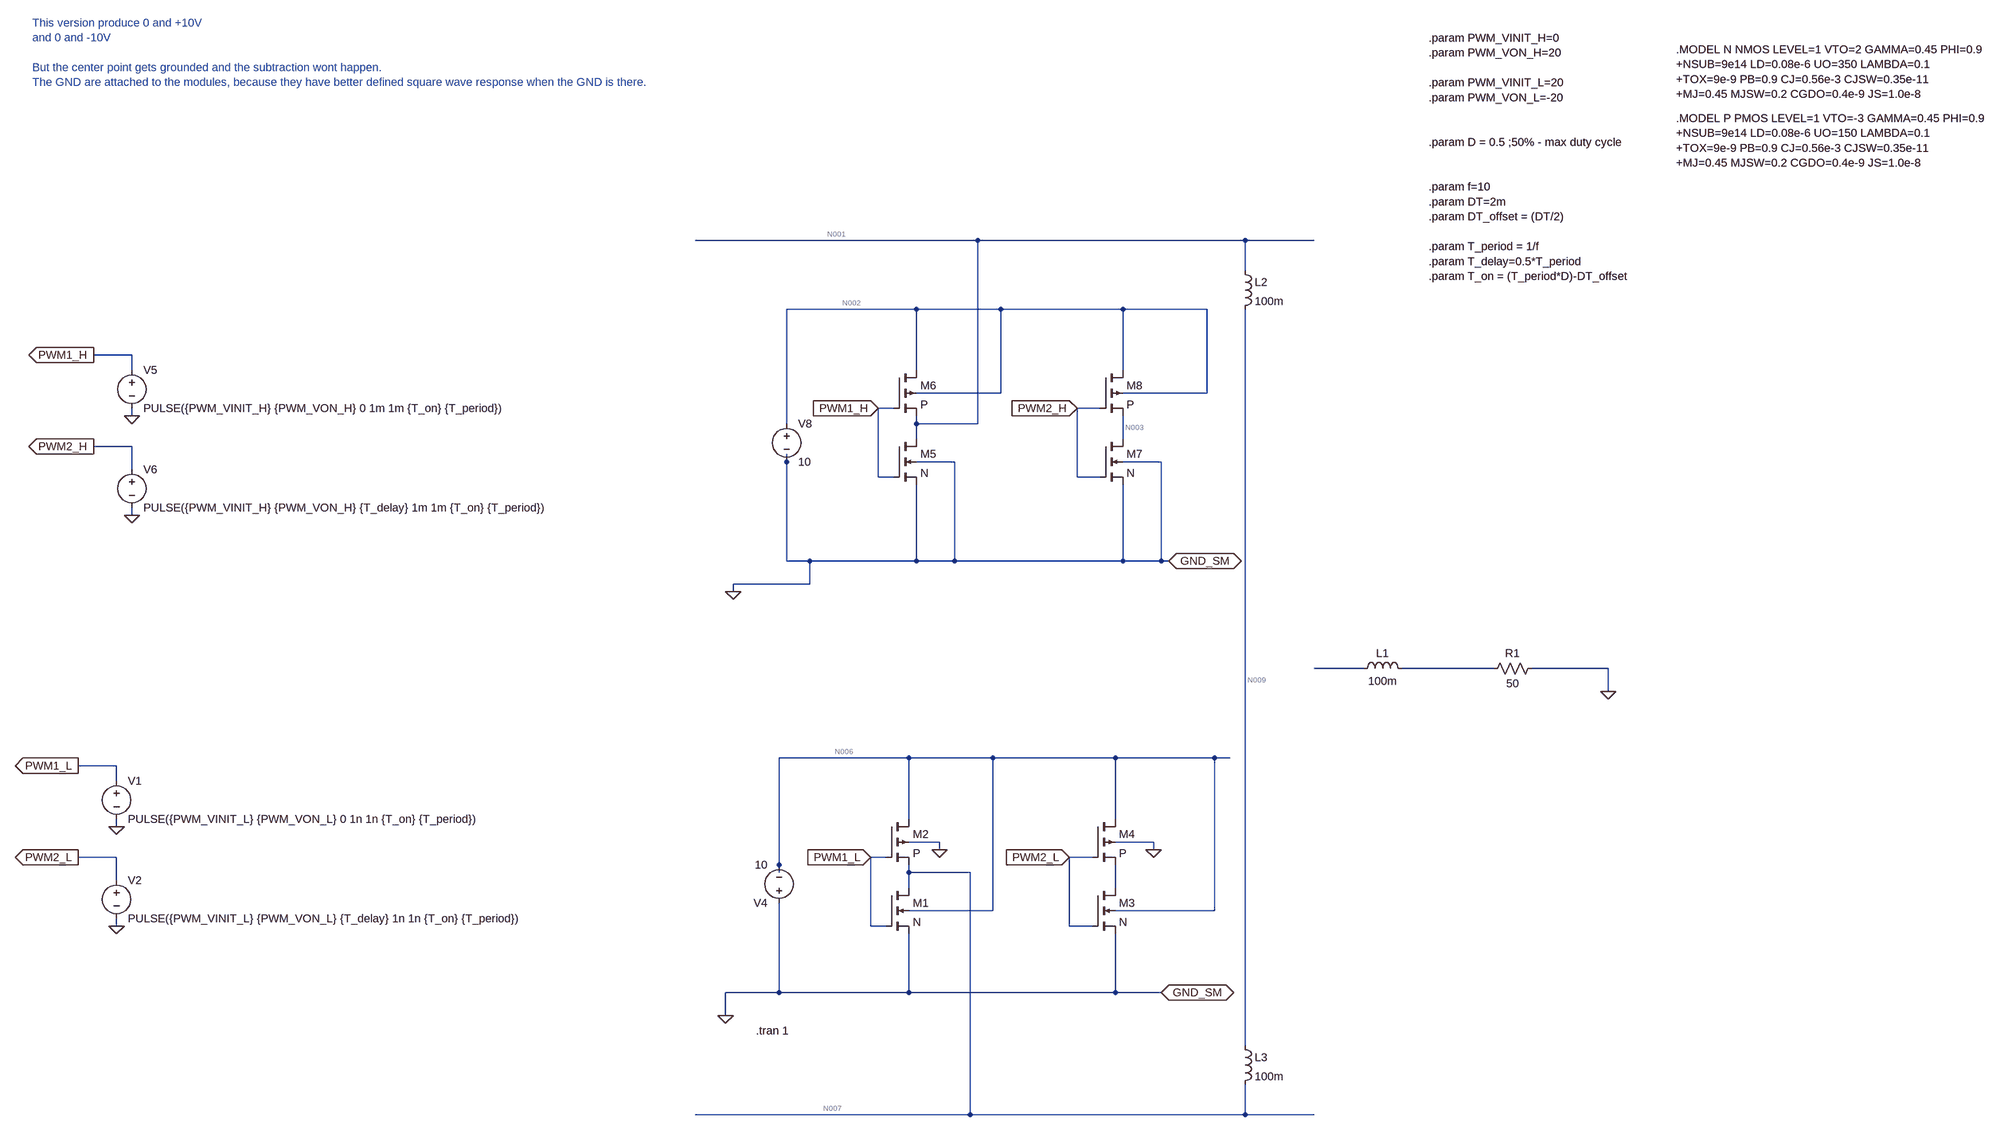
[diagram p0: schematic 2sb.asc]
2sb.asc, the LTspice schematic file:
Version 4.1
SHEET 1 1732 1656
WIRE -2432 -384 -3024 -384
WIRE -1872 -384 -2432 -384
WIRE -1728 -384 -1872 -384
WIRE -1872 -320 -1872 -384
WIRE -2560 -240 -2832 -240
WIRE -2384 -240 -2560 -240
WIRE -2128 -240 -2384 -240
WIRE -1952 -240 -2128 -240
WIRE -4208 -144 -4288 -144
WIRE -4208 -112 -4208 -144
WIRE -2560 -112 -2560 -240
WIRE -2128 -112 -2128 -240
WIRE -2384 -64 -2384 -240
WIRE -2384 -64 -2560 -64
WIRE -1952 -64 -1952 -240
WIRE -1952 -64 -2128 -64
WIRE -2608 -32 -2640 -32
WIRE -2176 -32 -2224 -32
WIRE -4208 -16 -4208 -32
WIRE -2832 0 -2832 -240
WIRE -2560 0 -2560 -16
WIRE -2432 0 -2432 -384
WIRE -2432 0 -2560 0
WIRE -2560 32 -2560 0
WIRE -2128 32 -2128 -16
WIRE -4208 48 -4288 48
WIRE -2832 80 -2832 64
WIRE -2480 80 -2560 80
WIRE -2048 80 -2128 80
WIRE -4208 96 -4208 48
WIRE -2640 112 -2640 -32
WIRE -2608 112 -2640 112
WIRE -2224 112 -2224 -32
WIRE -2176 112 -2224 112
WIRE -4208 192 -4208 176
WIRE -2832 288 -2832 80
WIRE -2784 288 -2832 288
WIRE -2560 288 -2560 128
WIRE -2560 288 -2784 288
WIRE -2480 288 -2480 80
WIRE -2480 288 -2560 288
WIRE -2128 288 -2128 128
WIRE -2128 288 -2480 288
WIRE -2048 288 -2048 80
WIRE -2048 288 -2128 288
WIRE -2032 288 -2048 288
WIRE -2784 336 -2784 288
WIRE -2784 336 -2944 336
WIRE -2944 352 -2944 336
WIRE -1344 608 -1728 608
WIRE -1072 608 -1264 608
WIRE -832 608 -992 608
WIRE -832 656 -832 608
WIRE -2576 864 -2848 864
WIRE -2400 864 -2576 864
WIRE -2144 864 -2400 864
WIRE -1936 864 -2144 864
WIRE -1904 864 -1936 864
WIRE -4240 880 -4320 880
WIRE -4240 912 -4240 880
WIRE -2576 992 -2576 864
WIRE -2144 992 -2144 864
WIRE -4240 1008 -4240 992
WIRE -2512 1040 -2576 1040
WIRE -2064 1040 -2144 1040
WIRE -2512 1056 -2512 1040
WIRE -2064 1056 -2064 1040
WIRE -4240 1072 -4320 1072
WIRE -2624 1072 -2656 1072
WIRE -2192 1072 -2240 1072
WIRE -2848 1088 -2848 864
WIRE -2848 1104 -2848 1088
WIRE -2576 1104 -2576 1088
WIRE -2448 1104 -2576 1104
WIRE -4240 1120 -4240 1072
WIRE -2576 1136 -2576 1104
WIRE -2144 1136 -2144 1088
WIRE -2400 1184 -2400 864
WIRE -2400 1184 -2576 1184
WIRE -1936 1184 -1936 864
WIRE -1936 1184 -2144 1184
WIRE -4240 1216 -4240 1200
WIRE -2656 1216 -2656 1072
WIRE -2624 1216 -2656 1216
WIRE -2240 1216 -2240 1072
WIRE -2192 1216 -2240 1216
WIRE -2848 1392 -2848 1168
WIRE -2848 1392 -2960 1392
WIRE -2576 1392 -2576 1232
WIRE -2576 1392 -2848 1392
WIRE -2144 1392 -2144 1232
WIRE -2144 1392 -2576 1392
WIRE -2048 1392 -2144 1392
WIRE -2960 1440 -2960 1392
WIRE -1872 1504 -1872 -240
WIRE -2448 1648 -2448 1104
WIRE -2448 1648 -3024 1648
WIRE -1872 1648 -1872 1584
WIRE -1872 1648 -2448 1648
WIRE -1728 1648 -1872 1648
FLAG -2656 1072 PWM1_L
IOPIN -2656 1072 In
FLAG -2240 1072 PWM2_L
IOPIN -2240 1072 In
FLAG -4240 1008 0
FLAG -4240 1216 0
FLAG -4320 880 PWM1_L
IOPIN -4320 880 Out
FLAG -4320 1072 PWM2_L
IOPIN -4320 1072 Out
FLAG -2048 1392 GND_SM
IOPIN -2048 1392 BiDir
FLAG -2512 1056 0
FLAG -2064 1056 0
FLAG -2640 -32 PWM1_H
IOPIN -2640 -32 In
FLAG -2224 -32 PWM2_H
IOPIN -2224 -32 In
FLAG -4208 -16 0
FLAG -4208 192 0
FLAG -4288 -144 PWM1_H
IOPIN -4288 -144 Out
FLAG -4288 48 PWM2_H
IOPIN -4288 48 Out
FLAG -2032 288 GND_SM
IOPIN -2032 288 BiDir
FLAG -2944 352 0
FLAG -2960 1440 0
FLAG -832 656 0
SYMBOL nmos4 -2624 1136 R0
SYMATTR InstName M1
SYMATTR Value N
SYMBOL pmos4 -2624 992 R0
SYMATTR InstName M2
SYMATTR Value P
SYMBOL nmos4 -2192 1136 R0
SYMATTR InstName M3
SYMATTR Value N
SYMBOL pmos4 -2192 992 R0
SYMATTR InstName M4
SYMATTR Value P
SYMBOL voltage -4240 896 R0
WINDOW 123 0 0 Left 0
WINDOW 39 0 0 Left 0
SYMATTR InstName V1
SYMATTR Value PULSE({PWM_VINIT_L} {PWM_VON_L} 0 1n 1n {T_on} {T_period})
SYMBOL voltage -4240 1104 R0
WINDOW 123 0 0 Left 0
WINDOW 39 0 0 Left 0
SYMATTR InstName V2
SYMATTR Value PULSE({PWM_VINIT_L} {PWM_VON_L} {T_delay} 1n 1n {T_on} {T_period})
SYMBOL voltage -2848 1184 R180
WINDOW 123 0 0 Left 0
WINDOW 39 0 0 Left 0
SYMATTR InstName V4
SYMATTR Value 10
SYMBOL nmos4 -2608 32 R0
SYMATTR InstName M5
SYMATTR Value N
SYMBOL pmos4 -2608 -112 R0
SYMATTR InstName M6
SYMATTR Value P
SYMBOL nmos4 -2176 32 R0
SYMATTR InstName M7
SYMATTR Value N
SYMBOL pmos4 -2176 -112 R0
SYMATTR InstName M8
SYMATTR Value P
SYMBOL voltage -4208 -128 R0
WINDOW 123 0 0 Left 0
WINDOW 39 0 0 Left 0
SYMATTR InstName V5
SYMATTR Value PULSE({PWM_VINIT_H} {PWM_VON_H} 0 1m 1m {T_on} {T_period})
SYMBOL voltage -4208 80 R0
WINDOW 123 0 0 Left 0
WINDOW 39 0 0 Left 0
SYMATTR InstName V6
SYMATTR Value PULSE({PWM_VINIT_H} {PWM_VON_H} {T_delay} 1m 1m {T_on} {T_period})
SYMBOL voltage -2832 -16 R0
WINDOW 123 0 0 Left 0
WINDOW 39 0 0 Left 0
SYMATTR InstName V8
SYMATTR Value 10
SYMBOL ind -1360 624 R270
WINDOW 0 32 56 VTop 2
WINDOW 3 5 56 VBottom 2
SYMATTR InstName L1
SYMATTR Value 100m
SYMBOL res -976 592 R90
WINDOW 0 0 56 VBottom 2
WINDOW 3 32 56 VTop 2
SYMATTR InstName R1
SYMATTR Value 50
SYMBOL ind -1888 -336 R0
SYMATTR InstName L2
SYMATTR Value 100m
SYMBOL ind -1888 1488 R0
SYMATTR InstName L3
SYMATTR Value 100m
TEXT 1064 -784 Left 2 !.MODEL N NMOS LEVEL=1 VTO=2 GAMMA=0.45 PHI=0.9\n+NSUB=9e14 LD=0.08e-6 UO=350 LAMBDA=0.1\n+TOX=9e-9 PB=0.9 CJ=0.56e-3 CJSW=0.35e-11\n+MJ=0.45 MJSW=0.2 CGDO=0.4e-9 JS=1.0e-8
TEXT 1064 -640 Left 2 !.MODEL P PMOS LEVEL=1 VTO=-3 GAMMA=0.45 PHI=0.9\n+NSUB=9e14 LD=0.08e-6 UO=150 LAMBDA=0.1\n+TOX=9e-9 PB=0.9 CJ=0.56e-3 CJSW=0.35e-11\n+MJ=0.45 MJSW=0.2 CGDO=0.4e-9 JS=1.0e-8
TEXT -1208 -808 Left 2 !.param PWM_VINIT_H=0\n.param PWM_VON_H=20\n \n.param PWM_VINIT_L=20\n.param PWM_VON_L=-20\n \n\n.param D = 0.5 ;50% - max duty cycle\n \n\n.param f=10\n.param DT=2m\n.param DT_offset = (DT/2)\n \n.param T_period = 1/f\n.param T_delay=0.5*T_period\n.param T_on = (T_period*D)-DT_offset
TEXT -2896 1472 Left 2 !.tran 1
TEXT -4416 -840 Left 2 ;This version produce 0 and +10V \nand 0 and -10V \n \nBut the center point gets grounded and the subtraction wont happen. \nThe GND are attached to the modules, because they have better defined square wave response when the GND is there.

The netlist it stands for:
* 2sb.asc
M1 N007 PWM1_L 0 N006 N
M2 N006 PWM1_L N007 0 P
M3 N008 PWM2_L 0 N006 N
M4 N006 PWM2_L N008 0 P
V1 PWM1_L 0 PULSE({PWM_VINIT_L} {PWM_VON_L} 0 1n 1n {T_on} {T_period})
V2 PWM2_L 0 PULSE({PWM_VINIT_L} {PWM_VON_L} {T_delay} 1n 1n {T_on} {T_period})
V4 0 N006 10
M5 N001 PWM1_H 0 0 N
M6 N002 PWM1_H N001 N002 P
M7 N003 PWM2_H 0 0 N
M8 N002 PWM2_H N003 N002 P
V5 PWM1_H 0 PULSE({PWM_VINIT_H} {PWM_VON_H} 0 1m 1m {T_on} {T_period})
V6 PWM2_H 0 PULSE({PWM_VINIT_H} {PWM_VON_H} {T_delay} 1m 1m {T_on} {T_period})
V8 N002 0 10
L1 N004 N005 100m
R1 0 N005 50
L2 N001 N009 100m
L3 N009 N007 100m
.model NMOS NMOS
.model PMOS PMOS
.lib standard.mos
.MODEL N NMOS LEVEL=1 VTO=2 GAMMA=0.45 PHI=0.9
+NSUB=9e14 LD=0.08e-6 UO=350 LAMBDA=0.1
+TOX=9e-9 PB=0.9 CJ=0.56e-3 CJSW=0.35e-11
+MJ=0.45 MJSW=0.2 CGDO=0.4e-9 JS=1.0e-8
.MODEL P PMOS LEVEL=1 VTO=-3 GAMMA=0.45 PHI=0.9
+NSUB=9e14 LD=0.08e-6 UO=150 LAMBDA=0.1
+TOX=9e-9 PB=0.9 CJ=0.56e-3 CJSW=0.35e-11
+MJ=0.45 MJSW=0.2 CGDO=0.4e-9 JS=1.0e-8
.param PWM_VINIT_H=0
.param PWM_VON_H=20
.param PWM_VINIT_L=20
.param PWM_VON_L=-20
.param D = 0.5 ;50% - max duty cycle
.param f=10
.param DT=2m
.param DT_offset = (DT/2)
.param T_period = 1/f
.param T_delay=0.5*T_period
.param T_on = (T_period*D)-DT_offset
.tran 1
* This version produce 0 and +10V
* and 0 and -10V
* But the center point gets grounded and the subtraction wont happen.
* The GND are attached to the modules, because they have better defined square wave response when the GND is there.
.backanno
.end

* Results of the author's LTspice run, read from the files saved beside the schematic
* Operating Point, zero values left out:
*   V(pwm1_l) = 20 V
*   V(pwm2_l) = 20 V
*   V(n009) = 659 mV
*   V(n007) = 659 mV
*   V(n006) = -10 V
*   V(n001) = 659 mV
*   V(n002) = 10 V
*   V(n003) = 10 V
*   Id(M1) = 1.569 mA
*   Is(M1) = -1.569 mA
*   Ib(M1) = -20.68 pA
*   Id(M5) = 1.328 pA
*   Id(M3) = -10 pA
*   Is(M3) = 30.02 pA
*   Ib(M3) = -20.02 pA
*   Id(M8) = 20.01 pA
*   Is(M8) = -20.01 pA
*   I(V8) = -2.732 mA
*   Id(M4) = -20.01 pA
*   Is(M4) = 10 pA
*   Ib(M4) = 10.01 pA
*   Id(M6) = 2.732 mA
*   Is(M6) = -2.732 mA
*   Ib(M6) = 9.351 pA
*   Id(M7) = 20.01 pA
*   Is(M7) = -10 pA
*   Ib(M7) = -10.01 pA
*   I(L2) = 2.732 mA
*   Id(M2) = -20.67 pA
*   Is(M2) = 1.162 mA
*   Ib(M2) = -1.162 mA
*   I(V4) = -81.38 pA
*   I(L3) = 2.732 mA
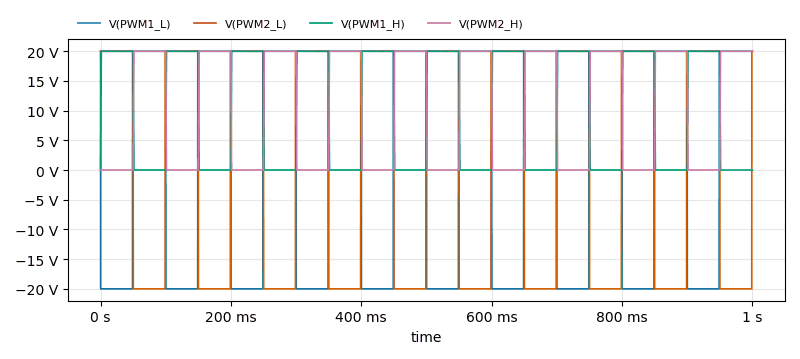
[diagram p1: Transient Analysis of 2sb.asc, plotted from the saved traces]
* Transient Analysis, 1 run:
*   V(PWM1_L): min -20 V, max 20 V, average 400 mV, rms 20 V, last 20 V
*   V(PWM2_L): min -20 V, max 20 V, average 400 mV, rms 20 V, last 20 V
*   V(PWM1_H): min 0 V, max 20 V, average 10 V, rms 14.1 V, last 0 V
*   V(PWM2_H): min 0 V, max 20 V, average 9.99 V, rms 14.09 V, last 20 V